# Altium schematic sheet key-cell.SchDoc
size A3; Hw_rev: R1; Address3: Firenze; Address4: ITALY; Revision: 0; SheetNumber: 3; SheetTotal: 3
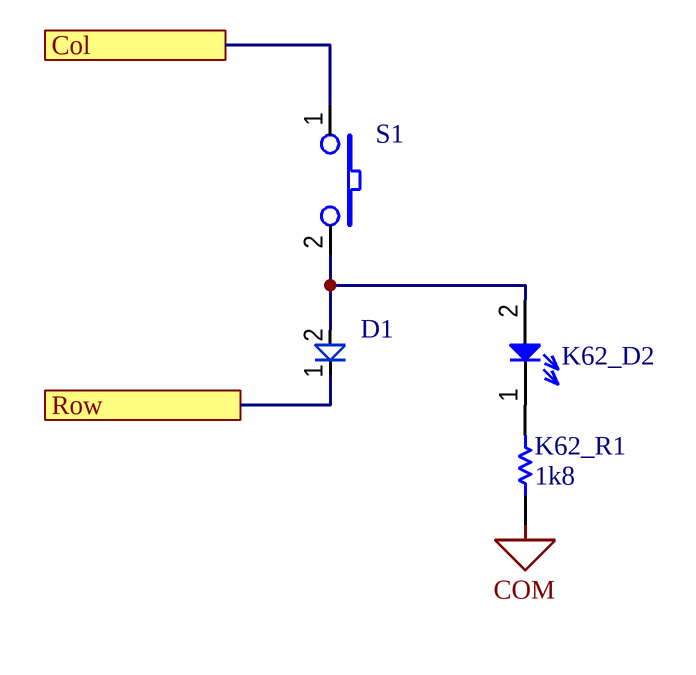
[diagram p0: key-cell.SchDoc]

## Parts
D1  B5819W  [SOD-123_K1-A2]  (value not drawn)
K62_D2  K  [0402_[1005]_K1-A2_LED]  (value not drawn)
K62_R1  1k8  [0402_[1005]]
S1  MecSwitch  [tactile_switch_gateron_pcb]  (value not drawn)

## Ports
Col, Row

## Nets
COM: K62_R1.1
Col: S1.1 ; port Col
Row: D1.1(K) ; port Row
NetD1_2: D1.2(A) K62_D2.2(A) S1.2
NetK62_D2_1: K62_D2.1(K) K62_R1.2

Not connected (* = marked no-connect by the designer): S1 3(GND) 4(GND)

## Notes on the sheet
- Title:
- Project:
- Desc:
- Variant:
- File:
- License:
- asterix24@gmail.com
- Ing. Daniele Basile
- Rev:
- Prj Rev:
- Status:
- Size:
- Date:
- Time:
- Sheet
- of
- A3

## Library data of the parts
D1 = diode_small: Diode Schottky  low Vf, If 1A ( LCSC `); CODE LCSC: C8598; MountTechnology: SMT
K62_D2 = DiodeLedSmall: Diode Led; Publisher: Develer srl; Revision: 0.1; NOTE Manufacturer PN: *; NOTE Manufacturer: *; MountTechnology: SMT; CODE Develer: *; NOTE Description: *; NOTE Description 2: *
K62_R1 = Res: Resistor; Publisher: Develer srl; Revision: 0.1; NOTE Manufacturer PN: *; NOTE Manufacturer: *; MountTechnology: SMT; CODE Develer: *; NOTE Description: *; NOTE Description 2: *
S1 = SWITCH-RA: Tactile Switch Right Angle 6x6; Part Number: Tyco FSMRA2JH; Purchase Code: RS 479-1520; MountTechnology: THD